# Altium schematic sheet 01 - Power Supply.SchDoc
size B; CompanyName: Microchip Technology Inc.; Organization: Microchip Technology; Address1: 2355 West Chandler Blvd.; Address2: Chandler, AZ  85224; Address4: USA; SheetNumber: 2; SheetTotal: 15; SheetTitle: Power Supply; Time: Time
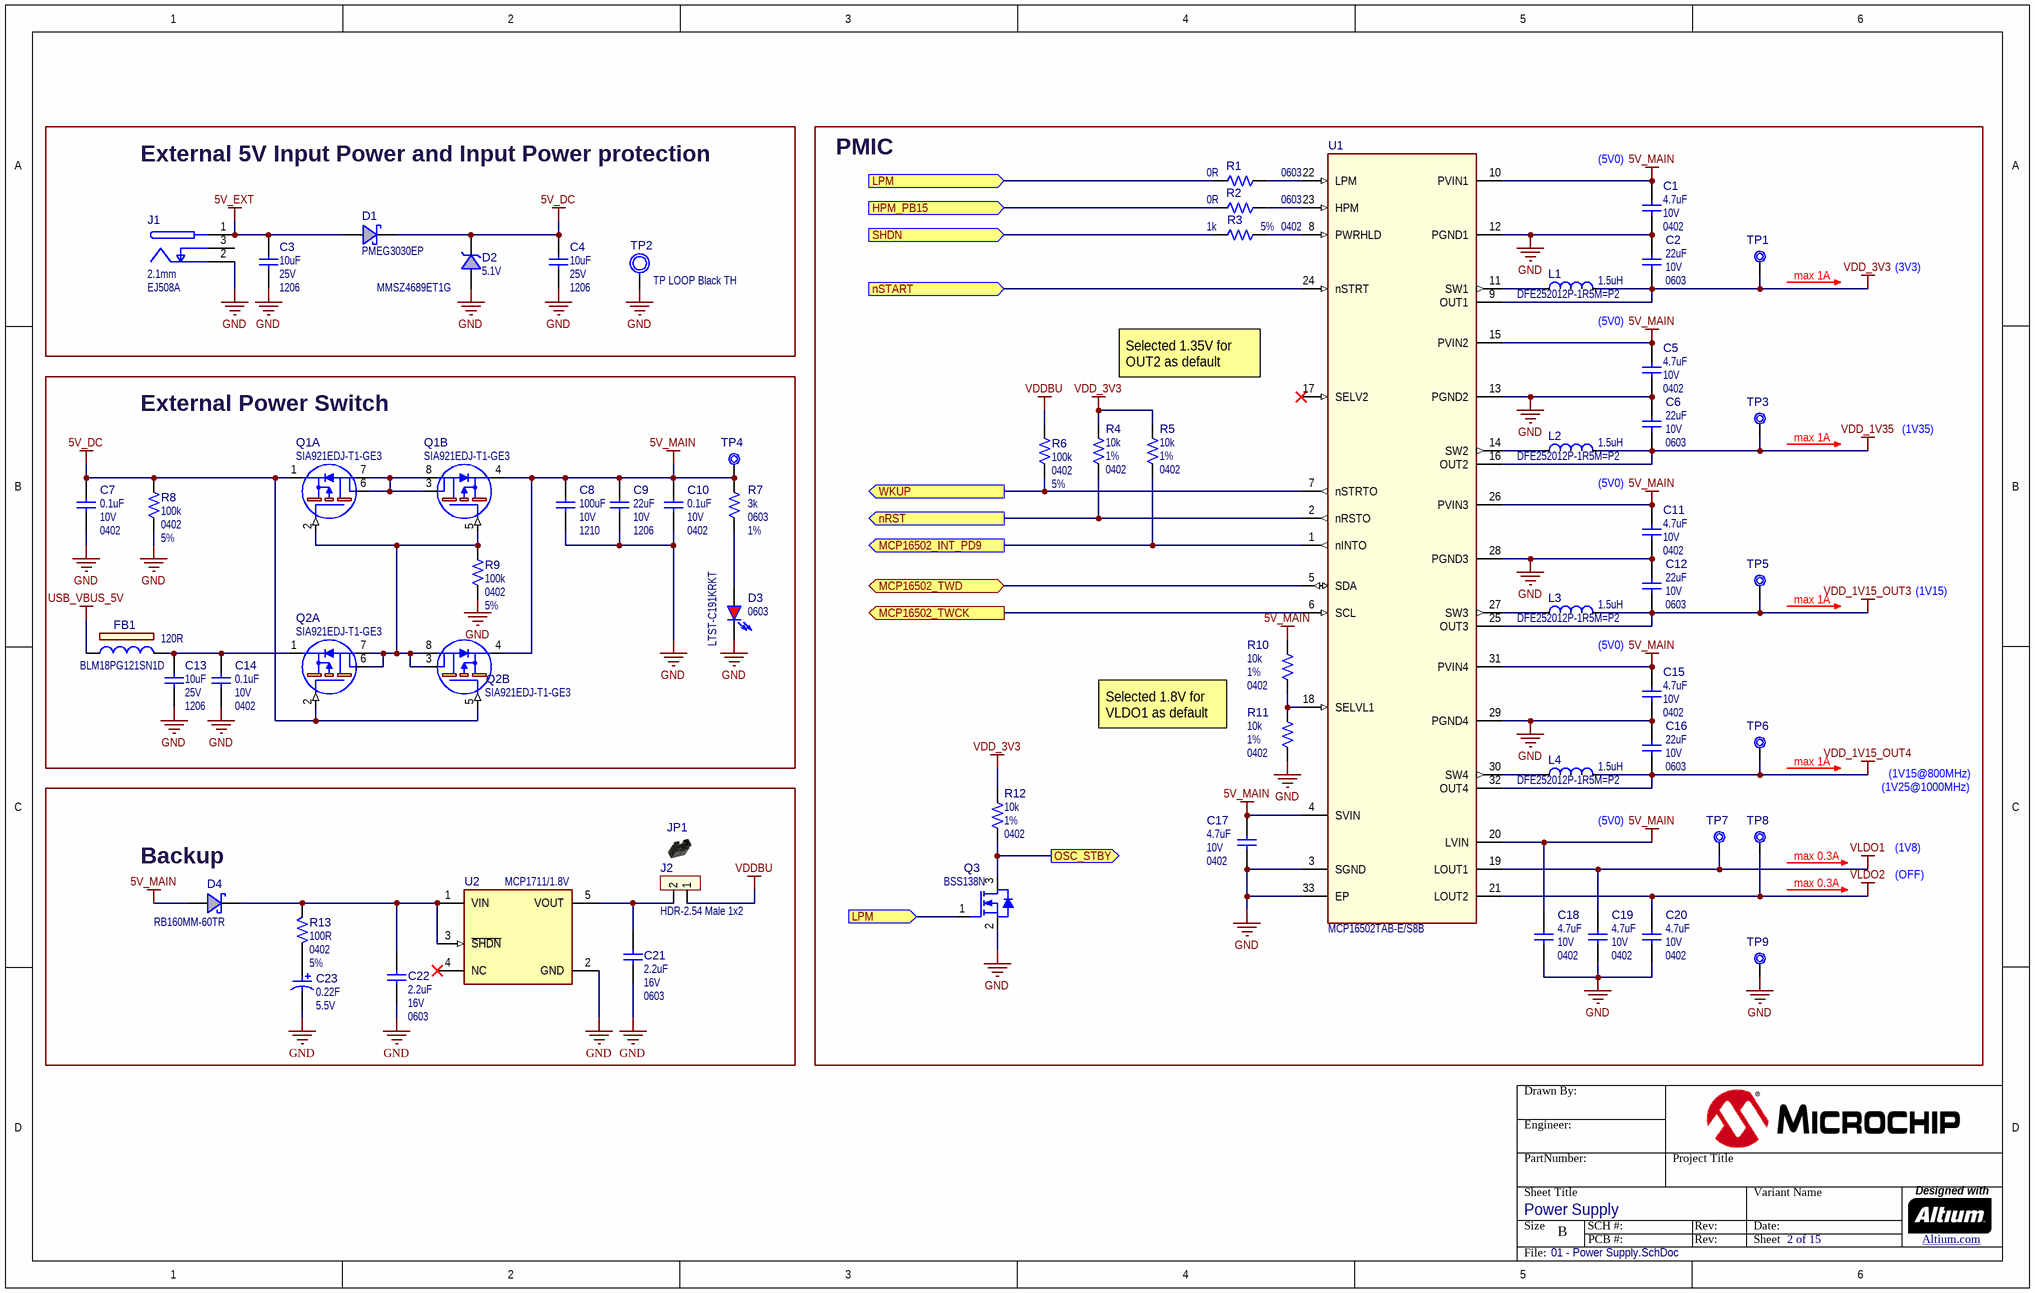
[diagram p0: 01 - Power Supply.SchDoc]

## Parts
?  (no value)  (graphical)
C1  value 4.7uF  Voltage: 10V  Package: 0402  [CAP_C_0402]  (hidden comment: Capacitor NP)
C2  value 22uF  Voltage: 10V  Package: 0603  [CAP_C_0603]  (hidden comment: Capacitor NP)
C3  value 10uF  Voltage: 25V  Package: 1206  [CAP_C_1206]  (hidden comment: Capacitor NP)
C4  value 10uF  Voltage: 25V  Package: 1206  [CAP_C_1206]  (hidden comment: Capacitor NP)
C5  value 4.7uF  Voltage: 10V  Package: 0402  [CAP_C_0402]  (hidden comment: Capacitor NP)
C6  value 22uF  Voltage: 10V  Package: 0603  [CAP_C_0603]  (hidden comment: Capacitor NP)
C7  value 0.1uF  Voltage: 10V  Package: 0402  [CAP_C_0402]  (hidden comment: Capacitor NP)
C8  value 100uF  Voltage: 10V  Package: 1210  [CAP_C_1210]  (hidden comment: Capacitor NP)
C9  value 22uF  Voltage: 10V  Package: 1206  [CAP_C_1206]  (hidden comment: Capacitor NP)
C10  value 0.1uF  Voltage: 10V  Package: 0402  [CAP_C_0402]  (hidden comment: Capacitor NP)
C11  value 4.7uF  Voltage: 10V  Package: 0402  [CAP_C_0402]  (hidden comment: Capacitor NP)
C12  value 22uF  Voltage: 10V  Package: 0603  [CAP_C_0603]  (hidden comment: Capacitor NP)
C13  value 10uF  Voltage: 25V  Package: 1206  [CAP_C_1206]  (hidden comment: Capacitor NP)
C14  value 0.1uF  Voltage: 10V  Package: 0402  [CAP_C_0402]  (hidden comment: Capacitor NP)
C15  value 4.7uF  Voltage: 10V  Package: 0402  [CAP_C_0402]  (hidden comment: Capacitor NP)
C16  value 22uF  Voltage: 10V  Package: 0603  [CAP_C_0603]  (hidden comment: Capacitor NP)
C17  value 4.7uF  Voltage: 10V  Package: 0402  [CAP_C_0402]  (hidden comment: Capacitor NP)
C18  value 4.7uF  Voltage: 10V  Package: 0402  [CAP_C_0402]  (hidden comment: Capacitor NP)
C19  value 4.7uF  Voltage: 10V  Package: 0402  [CAP_C_0402]  (hidden comment: Capacitor NP)
C20  value 4.7uF  Voltage: 10V  Package: 0402  [CAP_C_0402]  (hidden comment: Capacitor NP)
C21  value 2.2uF  Voltage: 16V  Package: 0603  [CAP_C_0603]  (hidden comment: Capacitor NP)
C22  value 2.2uF  Voltage: 16V  Package: 0603  [CAP_C_0603]  (hidden comment: Capacitor NP)
C23  value 0.22F  Voltage: 5.5V  [CAP_AX_KR-5R5V224-R]  (hidden comment: Capacitor POL)
D1  value PMEG3030EP  [SOD-128]  (hidden comment: Diode Schottky)
D2  value 5.1V  Manufacturer Part Number 1: MMSZ4689ET1G  [SOD-123]  (hidden comment: Diode Zener)
D3  Package: 0603  Manufacturer Part Number 1: LTST-C191KRKT  [LED_0603_RED]  (hidden comment: LED_red)
D4  value RB160MM-60TR  [SOD-123FL]  (hidden comment: Diode Schottky)
FB1  value 120R  Manufacturer Part Number 1: BLM18PG121SN1D  [IND_C_0603]  (hidden comment: Ferrite Bead)
J1  value 2.1mm  Manufacturer Part Number 1: EJ508A  [CON_JACK_POWER_TH_RA_MPD_EJ508A]  (hidden comment: CON JACK 2C 3P SPST)
J2  value HDR-2.54 Male 1x2  [HDR_M_2.54_1x2]  (hidden comment: Header 1x2)
JP1  Jumper Mechanical  [Jumper_Mechanical]  (value not drawn)  (mechanical)
L1  value 1.5uH  Manufacturer Part Number 1: DFE252012P-1R5M=P2  [IND_C_1008]  (hidden comment: Inductor)
L2  value 1.5uH  Manufacturer Part Number 1: DFE252012P-1R5M=P2  [IND_C_1008]  (hidden comment: Inductor)
L3  value 1.5uH  Manufacturer Part Number 1: DFE252012P-1R5M=P2  [IND_C_1008]  (hidden comment: Inductor)
L4  value 1.5uH  Manufacturer Part Number 1: DFE252012P-1R5M=P2  [IND_C_1008]  (hidden comment: Inductor)
Q1  Manufacturer Part Number 1: SIA921EDJ-T1-GE3  [SiA923AEDJ PPAK_SC70_6L]  (hidden comment: SIA923AEDJ-T1-GE3)  (parts A,B of 2)
Q2  Manufacturer Part Number 1: SIA921EDJ-T1-GE3  [SiA923AEDJ PPAK_SC70_6L]  (hidden comment: SIA923AEDJ-T1-GE3)  (parts A,B of 2)
Q3  value BSS138N  [SOT-23-3]  (hidden comment: Transistor MOS-N GSD)
R1  value 0R  Package: 0603  [RES_C_0603]  (hidden comment: Resistor)
R2  value 0R  Package: 0603  [RES_C_0603]  (hidden comment: Resistor)
R3  value 1k  Package: 0402  Tolerance: 5%  [RES_C_0402]  (hidden comment: Resistor)
R4  value 10k  Package: 0402  Tolerance: 1%  [RES_C_0402]  (hidden comment: Resistor)
R5  value 10k  Package: 0402  Tolerance: 1%  [RES_C_0402]  (hidden comment: Resistor)
R6  value 100k  Package: 0402  Tolerance: 5%  [RES_C_0402]  (hidden comment: Resistor)
R7  value 3k  Package: 0603  Tolerance: 1%  [RES_C_0603]  (hidden comment: Resistor)
R8  value 100k  Package: 0402  Tolerance: 5%  [RES_C_0402]  (hidden comment: Resistor)
R9  value 100k  Package: 0402  Tolerance: 5%  [RES_C_0402]  (hidden comment: Resistor)
R10  value 10k  Package: 0402  Tolerance: 1%  [RES_C_0402]  (hidden comment: Resistor)
R11  value 10k  Package: 0402  Tolerance: 1%  [RES_C_0402]  (hidden comment: Resistor)
R12  value 10k  Package: 0402  Tolerance: 1%  [RES_C_0402]  (hidden comment: Resistor)
R13  value 100R  Package: 0402  Tolerance: 5%  [RES_C_0402]  (hidden comment: Resistor)
TP1  Test Point No BOM  [TP_1mm_SMD]  (value not drawn)  (no BOM)
TP2  value TP LOOP Black TH  [CON_TP_TH_V_BLK_KEC_5011]  (hidden comment: GND)
TP3  Test Point No BOM  [TP_1mm_SMD]  (value not drawn)  (no BOM)
TP4  Test Point No BOM  [TP_1mm_SMD]  (value not drawn)  (no BOM)
TP5  Test Point No BOM  [TP_1mm_SMD]  (value not drawn)  (no BOM)
TP6  Test Point No BOM  [TP_1mm_SMD]  (value not drawn)  (no BOM)
TP7  Test Point No BOM  [TP_1mm_SMD]  (value not drawn)  (no BOM)
TP8  Test Point No BOM  [TP_1mm_SMD]  (value not drawn)  (no BOM)
TP9  Test Point No BOM  [TP_1mm_SMD]  (value not drawn)  (no BOM)
U1  value MCP16502TAB-E/S8B  [QFN-32_5X5_EP3.7X3.7]  (hidden comment: MCP16502 QFN-32)
U2  value MCP1711/1.8V  [SOT-23-5]  (hidden comment: MCP1711 SOT-23-5)

## Blocks framed on the sheet
External 5V Input Power and Input Power protection: C3 C4 D1 D2 J1 TP2
PMIC: C1 C2 C5 C6 C11 C12 C15-C20 L1-L4 Q3 R1-R6 R10-R12 TP1 TP3 TP5-TP9 U1
External Power Switch: C7-C10 C13 C14 D3 FB1 Q1 Q2 R7-R9 TP4
Backup: C21-C23 D4 J2 JP1 R13 U2

## Ports
HPM_PB15 (in), LPM (in), MCP16502_INT_PD9 (out), MCP16502_TWCK (out), MCP16502_TWD (bidir), nRST (out), nSTART (in), OSC_STBY (out), SHDN (in), WKUP (out)

## Nets
5V_DC: C4.1 C7.2 D1.2(K) D2.2(K) Q1.1(S1) Q2.2(G1) Q2.5(G2) R8.2
5V_EXT: C3.1 D1.1(A) J1.1(PLUS)
5V_MAIN: C1.2 C5.2 C8.2 C9.2 C10.2 C11.2 C15.2 C17.2 C18.2 D4.1(A) Q1.4(S2) Q2.4(S2) R7.1 R10.2 TP4.1 U1.4(SVIN) U1.10(PVIN1) U1.15(PVIN2) U1.20(LVIN) U1.26(PVIN3) U1.31(PVIN4)
GND: C1.1 C2.2 C3.2 C4.2 C5.1 C6.2 C7.1 C8.1 C9.1 C10.1 C11.1 C12.2 C13.2 C14.1 C15.1 C16.2 C17.1 C18.1 C19.1 C20.1 C21.1 C22.1 C23.2 D2.1(A) D3.2(K) J1.2(COM) Q3.2(S) R8.1 R9.1 R11.1 TP2.1 TP9.1 U1.3(SGND) U1.12(PGND1) U1.13(PGND2) U1.28(PGND3) U1.29(PGND4) U1.33(EP) U2.2(GND)
USB_VBUS_5V: FB1.1
VDD_1V15_OUT3: C12.1 L3.2(F) TP5.1 U1.25(OUT3)
VDD_1V15_OUT4: C16.1 L4.2(F) TP6.1 U1.32(OUT4)
VDD_1V35: C6.1 L2.2(F) TP3.1 U1.16(OUT2)
VDD_3V3: C2.1 L1.2(F) R4.2 R5.2 R12.2 TP1.1 U1.9(OUT1)
VDDBU: J2.1 R6.2
VLDO1: C19.2 TP7.1 U1.19(LOUT1)
VLDO2: C20.2 TP8.1 U1.21(LOUT2)
HPM_PB15: R2.2 ; port HPM_PB15
LPM: Q3.1(G) R1.1 ; port LPM
MCP16502_INT_PD9: R5.1 U1.1(nINTO) ; port MCP16502_INT_PD9
MCP16502_TWCK: U1.6(SCL) ; port MCP16502_TWCK
MCP16502_TWD: U1.5(SDA) ; port MCP16502_TWD
nRST: R4.1 U1.2(nRSTO) ; port nRST
nSTART: U1.24(nSTRT) ; port nSTART
OSC_STBY: Q3.3(D) R12.1 ; port OSC_STBY
SHDN: R3.2 ; port SHDN
WKUP: R6.1 U1.7(nSTRTO) ; port WKUP
NetC13_1: C13.1 C14.2 FB1.2 Q2.1(S1)
NetC21_2: C21.2 J2.2 U2.5(VOUT)
NetC22_2: C22.2 D4.2(K) R13.1 U2.1(VIN) U2.3(~{SHDN})
NetC23_1: C23.1 R13.2
NetD3_1: D3.1(A) R7.2
NetL1_1: L1.1(S) U1.11(SW1)
NetL2_1: L2.1(S) U1.14(SW2)
NetL3_1: L3.1(S) U1.27(SW3)
NetL4_1: L4.1(S) U1.30(SW4)
NetQ1_2: Q1.2(G1) Q1.5(G2) Q2.3(D2) Q2.6(D1) Q2.7(D1_2) Q2.8(D2_2) R9.2
NetQ1_3: Q1.3(D2) Q1.6(D1) Q1.7(D1_2) Q1.8(D2_2)
NetR1_2: R1.2 U1.22(LPM)
NetR2_1: R2.1 U1.23(HPM)
NetR3_1: R3.1 U1.8(PWRHLD)
NetR10_1: R10.1 R11.2 U1.18(SELVL1)

Not connected (* = marked no-connect by the designer): J1 3(SWITCH); U1 17(SELV2)*; U2 4(NC)*

## Notes on the sheet
- (near C1) (5V0)
- (near TP1) max 1A
- (3V3)
- Selected 1.35V for OUT2 as default
- (5V0)
- (near TP3) max 1A
- (1V35)
- (near TP5) max 1A
- (1V15)
- Selected 1.8V for VLDO1 as default
- (near TP6) max 1A
- (1V15@800MHz)
- (1V25@1000MHz)
- (near TP8) max 0.3A
- (1V8)
- (OFF)
- Drawn By:
- Engineer:
- PartNumber:
- Project Title
- Sheet Title
- Size
- B
- SCH #:
- PCB #:
- Rev:
- Variant Name
- Date:
- Sheet
- Designed with
- Altium.com <http://go.altium.com/MicrochipLandingPage_Evaluation.html>
- File:

## Library data of the parts
? = Title Block B
C1 C5 C11 C15 C17-C20 = CAP1684: Capacitor; Manufacturer 1: TDK Corporation; Manufacturer Part Number 1: C1005X5R1A475K050BC; Description_: CAP CER 4.7uF 10V 10% X5R SMD 0402; Dev Tools Status: Production; Tolerance: 10%; Temperature Coeffcient: X5R; Type: Ceramic; Owner: Jesus Aviles; Populated: YES; MCHP-ID: CAP1684; Revision: 1; Symbol: Capacitor NP; Status: MCL Design; ComponentLink1Description: SVN Datasheet; ComponentLink2Description: Local Datasheet; ComponentLink3URL: C:\ALTIUM_WORK\00001_MCHP-CDB\Library\LibraryRefs\Capacitor NP.SchLib; ComponentLink3Description: Open Symbol; ComponentLink4URL: C:\ALTIUM_WORK\00001_MCHP-CDB\Library\Footprints\CAP_C_0402.PcbLib; ComponentLink4Description: Open Footprint; ComponentLink5Description: Open Footprint 2; ComponentLink6Description: Open Footprint 3; ComponentLink7Description: Open Footprint 4; Operating Temperature: -55C to 85C; Category: Capacitor; Supplier 1: Digi-Key; Supplier Part Number 1: 445-13820-1-ND; Quantity Override: 1
C2 C6 C12 C16 = CAP1648: Capacitor; Manufacturer 1: TDK Corporation; Manufacturer Part Number 1: C1608X5R1A226M080AC; Description_: CAP CER 22uF 10V 20% X5R SMD 0603; Dev Tools Status: Production; Tolerance: 20%; Temperature Coeffcient: X5R; Type: Ceramic; Owner: Razvan Cristescu; Populated: YES; MCHP-ID: CAP1648; Revision: 1; Symbol: Capacitor NP; Status: MCL Design; ComponentLink1URL: https://chn-vm-apps.microchip.com/mchprepo/parts/Datasheets/1913358.pdf; ComponentLink1Description: SVN Datasheet; ComponentLink2URL: C:\ALTIUM_WORK\00001_MCHP-CDB\Datasheets\1913358.pdf; ComponentLink2Description: Local Datasheet; ComponentLink3URL: C:\ALTIUM_WORK\00001_MCHP-CDB\Library\LibraryRefs\Capacitor NP.SchLib; ComponentLink3Description: Open Symbol; ComponentLink4URL: C:\ALTIUM_WORK\00001_MCHP-CDB\Library\Footprints\CAP_C_0603.PcbLib; ComponentLink4Description: Open Footprint; ComponentLink5Description: Open Footprint 2; ComponentLink6Description: Open Footprint 3; ComponentLink7Description: Open Footprint 4; Operating Temperature: -55C to +85C; Category: Capacitor; Supplier 1: Farnell; Supplier Part Number 1: 2525091; Quantity Override: 1; Manufacturer 2: Murata Electronics North America; Manufacturer Part Number 2: GRM188R61A226ME15D; Supplier 2: Digi-Key; Supplier Part Number 2: 490-10476-1-ND
C3 C4 C13 = CAP1418: Capacitor; Manufacturer 1: Samsung Electro-Mechanics America, Inc; Manufacturer Part Number 1: CL31B106KAHNFNE; Description_: CAP CER 10uF 25V 10% X7R SMD 1206; Dev Tools Status: Design; Tolerance: 10%; Temperature Coeffcient: X7R; Type: Ceramic; Populated: YES; Owner: Sorin Stanoaia; MCHP-ID: CAP1418; Revision: A; Symbol: Capacitor NP; Status: MCL Design; ComponentLink1URL: https://chn-vm-apps.microchip.com/mchprepo/parts/Datasheets/C_CL31B106KAHNFNE.pdf; ComponentLink1Description: SVN Datasheet; ComponentLink2URL: C:\ALTIUM_WORK\00001_MCHP-CDB\Datasheets\C_CL31B106KAHNFNE.pdf; ComponentLink2Description: Local Datasheet; ComponentLink3URL: C:\ALTIUM_WORK\00001_MCHP-CDB\Library\LibraryRefs\Capacitor NP.SchLib; ComponentLink3Description: Open Symbol; ComponentLink4URL: C:\ALTIUM_WORK\00001_MCHP-CDB\Library\Footprints\CAP_C_1206.PcbLib; ComponentLink4Description: Open Footprint; ComponentLink5Description: Open Footprint 2; ComponentLink6Description: Open Footprint 3; ComponentLink7Description: Open Footprint 4; Operating Temperature: -55C to +125C; Category: Capacitor; Supplier 1: Digi-Key; Supplier Part Number 1: 1276-3100-1-ND; Quantity Override: 1
C7 C10 C14 = CAP1238: Capacitor; Manufacturer 1: KEMET; Manufacturer Part Number 1: C0402C104K8RACTU; Description_: CAP CER 0.1uF 10V 10% X7R SMD 0402; Dev Tools Status: Production; Tolerance: 10%; Temperature Coeffcient: X7R; Type: Ceramic; Owner: Tad Ahlvers; Populated: YES; MCHP-ID: CAP1238; Revision: 1; Symbol: Capacitor NP; Status: MCL Design; ComponentLink1URL: https://chn-vm-apps.microchip.com/mchprepo/parts/Datasheets/KEM_C1002_X7R_SMD.pdf; ComponentLink1Description: SVN Datasheet; ComponentLink2URL: C:\ALTIUM_WORK\00001_MCHP-CDB\Datasheets\KEM_C1002_X7R_SMD.pdf; ComponentLink2Description: Local Datasheet; ComponentLink3URL: C:\ALTIUM_WORK\00001_MCHP-CDB\Library\LibraryRefs\Capacitor NP.SchLib; ComponentLink3Description: Open Symbol; ComponentLink4URL: C:\ALTIUM_WORK\00001_MCHP-CDB\Library\Footprints\CAP_C_0402.PcbLib; ComponentLink4Description: Open Footprint; ComponentLink5Description: Open Footprint 2; ComponentLink6Description: Open Footprint 3; ComponentLink7Description: Open Footprint 4; Operating Temperature: -55C to +125C; Category: Capacitor; Manufacturer 2: Samsung; Manufacturer Part Number 2: CL05B104KP5NNNC; Manufacturer 3: Murata Electronics; Manufacturer Part Number 3: GRM155R71A104KA01D; Supplier 1: Digi-Key; Supplier Part Number 1: 399-3520-2-ND; Supplier 2: Digi-Key; Supplier Part Number 2: 1276-1002-2-ND; Supplier 3: Mouser; Supplier Part Number 3: 81-GRM155R71A104KA1D; Quantity Override: 1
C8 = CAP0598: Capacitor; Manufacturer 1: Murata Electronics North America; Manufacturer Part Number 1: GRM32ER61A107ME20L; Description_: CAP CER 100uF 10V 20% X5R SMD 1210; Dev Tools Status: Production; Tolerance: 20%; Temperature Coeffcient: X5R; Type: Ceramic; Populated: Yes; MCHP-ID: CAP0598; Revision: 1; Symbol: Capacitor NP; Status: MCL Design; ComponentLink1URL: https://chn-vm-apps.microchip.com/mchprepo/parts/Datasheets/mlcc01_e.pdf; ComponentLink1Description: SVN Datasheet; ComponentLink2URL: C:\ALTIUM_WORK\00001_MCHP-CDB\Datasheets\mlcc01_e.pdf; ComponentLink2Description: Local Datasheet; ComponentLink3URL: C:\ALTIUM_WORK\00001_MCHP-CDB\Library\LibraryRefs\Capacitor NP.SchLib; ComponentLink3Description: Open Symbol; ComponentLink4URL: C:\ALTIUM_WORK\00001_MCHP-CDB\Library\Footprints\CAP_C_1210.PcbLib; ComponentLink4Description: Open Footprint; ComponentLink5Description: Open Footprint 2; ComponentLink6Description: Open Footprint 3; ComponentLink7Description: Open Footprint 4; Operating Temperature: -55C to +85C; Category: Capacitor; Manufacturer 2: Taiyo Yuden; Manufacturer Part Number 2: LMK325BJ107MM-T; Supplier 1: Digi-Key; Supplier Part Number 1: 490-9969-1-ND; Supplier 2: Digi-Key; Supplier Part Number 2: 587-1965-1-ND; Quantity Override: 1
C9 = CAP1259: Capacitor; Manufacturer 1: Samsung Electro-Mechanics America, Inc; Manufacturer Part Number 1: CL31B226KPHNNNE; Description_: CAP CER 22uF 10V 10% X7R SMD 1206; Dev Tools Status: Production; Tolerance: 10%; Temperature Coeffcient: X7R; Type: Ceramic; Owner: Bogdan Popescu; Populated: YES; MCHP-ID: CAP1259; Revision: 1; Symbol: Capacitor NP; Status: MCL Design; ComponentLink1URL: https://chn-vm-apps.microchip.com/mchprepo/parts/Datasheets/CL31B226KPHNNNE.pdf; ComponentLink1Description: SVN Datasheet; ComponentLink2URL: C:\ALTIUM_WORK\00001_MCHP-CDB\Datasheets\CL31B226KPHNNNE.pdf; ComponentLink2Description: Local Datasheet; ComponentLink3URL: C:\ALTIUM_WORK\00001_MCHP-CDB\Library\LibraryRefs\Capacitor NP.SchLib; ComponentLink3Description: Open Symbol; ComponentLink4URL: C:\ALTIUM_WORK\00001_MCHP-CDB\Library\Footprints\CAP_C_1206.PcbLib; ComponentLink4Description: Open Footprint; ComponentLink5Description: Open Footprint 2; ComponentLink6Description: Open Footprint 3; ComponentLink7Description: Open Footprint 4; Operating Temperature: -55C to +125C; Category: Capacitor; Supplier 1: Digi-Key; Supplier Part Number 1: 1276-2769-1-ND; Quantity Override: 1
C21 C22 = CAP0597: Capacitor; Manufacturer 1: TDK; Manufacturer Part Number 1: C1608X5R1C225K; Description_: CAP CER 2.2uF 16V 10% X5R SMD 0603; Dev Tools Status: Production; Tolerance: 10%; Temperature Coeffcient: X5R; Type: Ceramic; Populated: Yes; MCHP-ID: CAP0597; Revision: 2; Symbol: Capacitor NP; Status: MCL Design; ComponentLink1URL: https://chn-vm-apps.microchip.com/mchprepo/parts/Datasheets/general_B11.pdf; ComponentLink1Description: SVN Datasheet; ComponentLink2URL: C:\ALTIUM_WORK\00001_MCHP-CDB\Datasheets\general_B11.pdf; ComponentLink2Description: Local Datasheet; ComponentLink3URL: C:\ALTIUM_WORK\00001_MCHP-CDB\Library\LibraryRefs\Capacitor NP.SchLib; ComponentLink3Description: Open Symbol; ComponentLink4URL: C:\ALTIUM_WORK\00001_MCHP-CDB\Library\Footprints\CAP_C_0603.PcbLib; ComponentLink4Description: Open Footprint; ComponentLink5Description: Open Footprint 2; ComponentLink6Description: Open Footprint 3; ComponentLink7Description: Open Footprint 4; Operating Temperature: -55C to +85C; Category: Capacitor; Supplier 1: Digi-Key; Supplier Part Number 1: 445-5157-1-ND; Quantity Override: 1
C23 = CAP2001: Capacitor; Manufacturer 1: Eaton; Manufacturer Part Number 1: KR-5R5V224-R; Description_: CAP SUPERCAP 220mF 5.5V -20% +80% 75Ohm RAD P5L10.5D11.5H11.5; Dev Tools Status: Design; Tolerance: -20% to +80%; ESR: 75R; Type: Supercap; Owner: Dragos Danaila; Populated: YES; MCHP-ID: CAP2001; Revision: A; Symbol: Capacitor POL; Status: MCL Design; ComponentLink1URL: https://chn-vm-apps.microchip.com/mchprepo/parts/Datasheets/Bus_Elx_DS_4327_KR_Series-479311.pdf; ComponentLink1Description: SVN Datasheet; ComponentLink2URL: C:\ALTIUM_WORK\00001_MCHP-CDB\Datasheets\Bus_Elx_DS_4327_KR_Series-479311.pdf; ComponentLink2Description: Local Datasheet; ComponentLink3URL: C:\ALTIUM_WORK\00001_MCHP-CDB\Library\LibraryRefs\Capacitor POL.SchLib; ComponentLink3Description: Open Symbol; ComponentLink4URL: C:\ALTIUM_WORK\00001_MCHP-CDB\Library\Footprints\CAP_AX_KR-5R5V224-R.PcbLib; ComponentLink4Description: Open Footprint; ComponentLink5Description: Open Footprint 2; ComponentLink6Description: Open Footprint 3; ComponentLink7Description: Open Footprint 4; Operating Temperature: -25C to +70C; Category: Capacitor; Supplier 1: Mouser; Supplier Part Number 1: 504-KR-5R5V224-R; Quantity Override: 1
D1 = DIODE1312: Manufacturer 1: Nexperia USA Inc.; Manufacturer Part Number 1: PMEG3030EP,115; Description_: DIO SCTKY PMEG3030EP,115 30V 3A SMD SOD-128; Dev Tools Status: Design; Type: Schottky Single; Reverse Current: 5mA; Reverse Voltage: 30V; Owner: Mark Loper; Populated: YES; MCHP-ID: DIODE1312; Revision: A; Symbol: Diode Schottky; Status: MCL Design; Package: SOD-128; ComponentLink1URL: https://chn-vm-apps.microchip.com/mchprepo/parts/Datasheets/PMEG3030EP.pdf; ComponentLink1Description: SVN Datasheet; ComponentLink2URL: C:\ALTIUM_WORK\00001_MCHP-CDB\Datasheets\PMEG3030EP.pdf; ComponentLink2Description: Local Datasheet; ComponentLink3URL: C:\ALTIUM_WORK\00001_MCHP-CDB\Library\LibraryRefs\Diode Schottky.SchLib; ComponentLink3Description: Open Symbol; ComponentLink4URL: C:\ALTIUM_WORK\00001_MCHP-CDB\Library\Footprints\SOD-128.PcbLib; ComponentLink4Description: Open Footprint; ComponentLink5Description: Open Footprint 2; ComponentLink6Description: Open Footprint 3; ComponentLink7Description: Open Footprint 4; Category: Diode; Supplier 1: Digi-Key; Supplier Part Number 1: 1727-5324-1-ND; Quantity Override: 1
D2 = DIODE1230: Manufacturer 1: Fairchild Semiconductor; Description_: DIO ZNR MMSZ4689ET1G 5.1V 500mW SMD SOD-123; Dev Tools Status: Design; Type: Zener Single; Forward Current: 10mA; Power: 500mW; Reverse Current: 10µA; Reverse Voltage: 3V; Owner: Cristian Papuc; Populated: YES; MCHP-ID: DIODE1230; Revision: 1; Symbol: Diode Zener; Status: MCL Design; Package: SOD-123; ComponentLink1URL: https://chn-vm-apps.microchip.com/mchprepo/parts/Datasheets/SZ,MMSZ4yyyET1G SeriesG_Series.pdf; ComponentLink1Description: SVN Datasheet; ComponentLink2URL: C:\ALTIUM_WORK\00001_MCHP-CDB\Datasheets\SZ,MMSZ4yyyET1G SeriesG_Series.pdf; ComponentLink2Description: Local Datasheet; ComponentLink3URL: C:\ALTIUM_WORK\00001_MCHP-CDB\Library\LibraryRefs\Diode Zener.SchLib; ComponentLink3Description: Open Symbol; ComponentLink4URL: C:\ALTIUM_WORK\00001_MCHP-CDB\Library\Footprints\SOD-123.PcbLib; ComponentLink4Description: Open Footprint; ComponentLink5Description: Open Footprint 2; ComponentLink6Description: Open Footprint 3; ComponentLink7Description: Open Footprint 4; Operating Temperature: -55C to +150C; Category: Diode; Supplier 1: Digi-Key; Supplier Part Number 1: MMSZ4689ET1GOSCT-ND; Quantity Override: 1
D3 = LED1073: LED; Manufacturer 1: Lite-On Inc.; Value: RED; Description_: DIO RED 2V 20mA 54mcd CLEAR SMD 0603; Dev Tools Status: Production; Type: LED Single; Forward Current: 20mA; Owner: Sompoch Loboonlert; Populated: YES; MCHP-ID: LED1073; Revision: 2; Symbol: LED_RED; Status: MCL Design; ComponentLink1URL: https://chn-vm-apps.microchip.com/mchprepo/parts/Datasheets/LTST-C191KRKT.PDF; ComponentLink1Description: SVN Datasheet; ComponentLink2URL: C:\ALTIUM_WORK\00001_MCHP-CDB\Datasheets\LTST-C191KRKT.PDF; ComponentLink2Description: Local Datasheet; ComponentLink3URL: C:\ALTIUM_WORK\00001_MCHP-CDB\Library\LibraryRefs\LED_RED.SchLib; ComponentLink3Description: Open Symbol; ComponentLink4URL: C:\ALTIUM_WORK\00001_MCHP-CDB\Library\Footprints\LED_0603_RED.PcbLib; ComponentLink4Description: Open Footprint; ComponentLink5Description: Open Footprint 2; ComponentLink6Description: Open Footprint 3; ComponentLink7Description: Open Footprint 4; Category: Diode; Supplier 1: Digi-Key; Supplier Part Number 1: 160-1447-1-ND; Quantity Override: 1
D4 = DIODE1609: DIO SCTKY RB160M-60TR 550mV 1A 60V SMD SOD-123F; Manufacturer 1: Rohm Semiconductor; Description_: DIO SCTKY RB160MM-60TR 550mV 1A 60V SMD SOD-123F; Dev Tools Status: Design; Type: Schottky Single; Power: 1W; Reverse Current: 50uA; Populated: YES; Owner: Ciprian Abramov; MCHP-ID: DIODE1609; Revision: 1; Symbol: Diode Schottky; Status: MCL Design; Package: SOD-123F; ComponentLink1URL: https://chn-vm-apps.microchip.com/mchprepo/parts/Datasheets/rb160m-60-210199.pdf; ComponentLink1Description: SVN Datasheet; ComponentLink2URL: C:\ALTIUM_WORK\00001_MCHP-CDB\Datasheets\rb160m-60-210199.pdf; ComponentLink2Description: Local Datasheet; ComponentLink3URL: C:\ALTIUM_WORK\00001_MCHP-CDB\Library\LibraryRefs\Diode Schottky.SchLib; ComponentLink3Description: Open Symbol; ComponentLink4URL: C:\ALTIUM_WORK\00001_MCHP-CDB\Library\Footprints\SOD-123FL.PcbLib; ComponentLink4Description: Open Footprint; ComponentLink5Description: Open Footprint 2; ComponentLink6Description: Open Footprint 3; ComponentLink7Description: Open Footprint 4; Operating Temperature: -40C to +150C; Category: Diode; Forward Current: 1A; Reverse Voltage: 60V; Manufacturer Part Number 1: RB160MM-60TR; Supplier 1: Digi-Key; Supplier Part Number 1: RB160MM-60CT-ND; Quantity Override: 1
FB1 = IND1009: Manufacturer 1: Murata; Description_: FERRITE 120R@100MHz 2A SMD 0603; Dev Tools Status: Production; Owner: Petnarong Chaijaroong; DCR: 0.05R; Saturation Current: 12A; Populated: Yes; MCHP-ID: IND1009; Revision: 0; Symbol: Ferrite Bead; Status: MCL Design; ComponentLink1URL: https://chn-vm-apps.microchip.com/mchprepo/parts/Datasheets/L0110S0100BLM18P.pdf; ComponentLink1Description: SVN Datasheet; ComponentLink2URL: C:\ALTIUM_WORK\00001_MCHP-CDB\Datasheets\L0110S0100BLM18P.pdf; ComponentLink2Description: Local Datasheet; ComponentLink3URL: C:\ALTIUM_WORK\00001_MCHP-CDB\Library\LibraryRefs\Ferrite Bead.SchLib; ComponentLink3Description: Open Symbol; ComponentLink4URL: C:\ALTIUM_WORK\00001_MCHP-CDB\Library\Footprints\IND_C_0603.PcbLib; ComponentLink4Description: Open Footprint; ComponentLink5Description: Open Footprint 2; ComponentLink6Description: Open Footprint 3; ComponentLink7Description: Open Footprint 4; Operating Temperature: -55C to +125C; Package: 0603; Type: Ferrite Bead; Category: Inductor; Supplier 1: Digi-Key; Supplier Part Number 1: 490-1037-1-ND; Quantity Override: 1
J1 = CON1560: Manufacturer 1: MPD (Memory Protection Devices); Description_: CON POWER 2.1mm 5.5mm Switch Slotted TH R/A; Dev Tools Status: Production; Populated: YES; Owner: Mark Loper; MCHP-ID: CON1560; Revision: 1; Symbol: CON JACK 2C 3P SPST; Status: MCL Design; ComponentLink1URL: https://chn-vm-apps.microchip.com/mchprepo/parts/Datasheets/EJ508A-datasheet.pdf; ComponentLink1Description: SVN Datasheet; ComponentLink2URL: C:\ALTIUM_WORK\00001_MCHP-CDB\Datasheets\EJ508A-datasheet.pdf; ComponentLink2Description: Local Datasheet; ComponentLink3URL: C:\ALTIUM_WORK\00001_MCHP-CDB\Library\LibraryRefs\CON JACK 2C 3P SPST.SchLib; ComponentLink3Description: Open Symbol; ComponentLink4URL: C:\ALTIUM_WORK\00001_MCHP-CDB\Library\Footprints\CON_JACK_POWER_TH_RA_MPD_EJ508A.PcbLib; ComponentLink4Description: Open Footprint; ComponentLink5Description: Open Footprint 2; ComponentLink6Description: Open Footprint 3; ComponentLink7Description: Open Footprint 4; Type: Jack; Category: Connector; Supplier 1: Digi-Key; Supplier Part Number 1: EJ508A-ND; Quantity Override: 1
J2 = CON1803: Manufacturer 1: Samtec Inc.; Manufacturer Part Number 1: TSW-102-07-G-S; Description_: CON HDR-2.54 Male 1x2 AU 5.84MH TH VERT; Dev Tools Status: Design; Owner: Ilie Galan; Populated: YES; MCHP-ID: CON1803; Revision: A; Symbol: Header 1x2; Status: MCL Design; ComponentLink1URL: https://chn-vm-apps.microchip.com/mchprepo/parts/Datasheets/tsw-xxx-xx-xxx-x-xx-xxx-mkt.pdf; ComponentLink1Description: SVN Datasheet; ComponentLink2URL: C:\ALTIUM_WORK\00001_MCHP-CDB\Datasheets\tsw-xxx-xx-xxx-x-xx-xxx-mkt.pdf; ComponentLink2Description: Local Datasheet; ComponentLink3URL: C:\ALTIUM_WORK\00001_MCHP-CDB\Library\LibraryRefs\Header 1x2.SchLib; ComponentLink3Description: Open Symbol; ComponentLink4URL: C:\ALTIUM_WORK\00001_MCHP-CDB\Library\Footprints\HDR_M_2.54_1x2.PcbLib; ComponentLink4Description: Open Footprint; ComponentLink5Description: Open Footprint 2; ComponentLink6Description: Open Footprint 3; ComponentLink7Description: Open Footprint 4; Type: Header 2.54mm; Category: Connector; Supplier 1: Digi-Key; Supplier Part Number 1: SAM1029-02-ND; Quantity Override: 1
JP1 = MECH0174: Manufacturer 1: Wurth Electronics Inc.; Manufacturer Part Number 1: 60900213421; Value: Shunt 2.54mm 1x2; Description_: MECH HW JUMPER 2.54mm 1x2 GOLD; Dev Tools Status: Production; Owner: Narasimha Murthy; Populated: MECH; MCHP-ID: MECH0174; Revision: 1; Symbol: Jumper Mechanical; Status: MCL Design; ComponentLink1URL: https://chn-vm-apps.microchip.com/mchprepo/parts/Datasheets/60900213421.pdf; ComponentLink1Description: SVN Datasheet; ComponentLink2URL: C:\ALTIUM_WORK\00001_MCHP-CDB\Datasheets\60900213421.pdf; ComponentLink2Description: Local Datasheet; ComponentLink3URL: C:\ALTIUM_WORK\00001_MCHP-CDB\Library\LibraryRefs\Jumper Mechanical.SchLib; ComponentLink3Description: Open Symbol; ComponentLink4URL: C:\ALTIUM_WORK\00001_MCHP-CDB\Library\Footprints\Jumper_Mechanical.PcbLib; ComponentLink4Description: Open Footprint; ComponentLink5Description: Open Footprint 2; ComponentLink6Description: Open Footprint 3; ComponentLink7Description: Open Footprint 4; Type: Jumper; Category: Hardware; Supplier 1: Digi-Key; Supplier Part Number 1: 732-2678-ND; Quantity Override: 1
L1-L4 = IND1335: Manufacturer 1: Murata Electronics North America; Description_: INDUCTOR 1.5uH 3.5A 20% SMD 1008; Dev Tools Status: Design; Owner: Razvan Cristescu; DCR: 0.06R; RMS Current: 3.5A; Test Frequency: 1MHz; Populated: YES; MCHP-ID: IND1335; Revision: A; Symbol: Inductor; Status: MCL Design; ComponentLink1URL: https://chn-vm-apps.microchip.com/mchprepo/parts/Datasheets/m_dfe252012p.pdf; ComponentLink1Description: SVN Datasheet; ComponentLink2URL: C:\ALTIUM_WORK\00001_MCHP-CDB\Datasheets\m_dfe252012p.pdf; ComponentLink2Description: Local Datasheet; ComponentLink3URL: C:\ALTIUM_WORK\00001_MCHP-CDB\Library\LibraryRefs\Inductor.SchLib; ComponentLink3Description: Open Symbol; ComponentLink4URL: C:\ALTIUM_WORK\00001_MCHP-CDB\Library\Footprints\IND_C_1008.PcbLib; ComponentLink4Description: Open Footprint; ComponentLink5Description: Open Footprint 2; ComponentLink6Description: Open Footprint 3; ComponentLink7Description: Open Footprint 4; Package: 1008; Type: Inductor; Category: Inductor; Supplier 1: Digi-Key; Supplier Part Number 1: 490-10648-6-ND; Quantity Override: 1
Q1 Q2 = TRA1527: Manufacturer 1: Vishay Siliconix; Value: SIA921EDJ-T1-GE3; Description_: TRANS FET DUAL P+P SIA923AEDJ -20V -4.5A 7.8W SC70-6L; Dev Tools Status: Design; Type: FET; Current: 4.5A; Drain to Source Voltage: 20V; Gate to Source Voltage: -1.4V; Power: 7.8W; Owner: Ciprian Abramov; Populated: YES; MCHP-ID: TRA1527; Revision: 1; Symbol: Transistor MOS-P+P Dual SIA923AEDJ-T1-GE3; Status: MCL Design; Package: PowerPAK® SC-70-6 Dual; ComponentLink1URL: https://chn-vm-apps.microchip.com/mchprepo/parts/Datasheets/sia921ed.pdf; ComponentLink1Description: SVN Datasheet; ComponentLink2URL: C:\ALTIUM_WORK\00001_MCHP-CDB\Datasheets\sia921ed.pdf; ComponentLink2Description: Local Datasheet; ComponentLink3URL: C:\ALTIUM_WORK\00001_MCHP-CDB\Library\LibraryRefs\Transistor MOS-P+P Dual SIA923AEDJ-T1-GE3.SchLib; ComponentLink3Description: Open Symbol; ComponentLink4URL: C:\ALTIUM_WORK\00001_MCHP-CDB\Library\Footprints\SiA923AEDJ PPAK_SC70_6L.PcbLib; ComponentLink4Description: Open Footprint; ComponentLink5Description: Open Footprint 2; ComponentLink6Description: Open Footprint 3; ComponentLink7Description: Open Footprint 4; Operating Temperature: -55C to +150C; Category: Transistor; Voltage: 20V; Supplier 1: Digi-Key; Supplier Part Number 1: SIA921EDJ-T1-GE3CT-ND; Quantity Override: 1
Q3 = TRA1223: Transistor MOS; Manufacturer 1: Infineon Technologies; Manufacturer Part Number 1: BSS138NH6327XTSA2; Description_: TRANS FET N-CH BSS138N 60V 230mA SOT23-3; Dev Tools Status: Production; Type: FET; Current: 230mA; Drain to Source Voltage: 60V; Gate to Source Voltage: 20V; Power: 0.36W; Owner: Dragos Danaila; Populated: YES; MCHP-ID: TRA1223; Revision: 1; Symbol: Transistor MOS-N GSD; Status: MCL Design; Package: SOT23-3; ComponentLink1URL: https://chn-vm-apps.microchip.com/mchprepo/parts/Datasheets/Infineon-BSS138N-DS-v02_86-en.pdf; ComponentLink1Description: SVN Datasheet; ComponentLink2URL: C:\ALTIUM_WORK\00001_MCHP-CDB\Datasheets\Infineon-BSS138N-DS-v02_86-en.pdf; ComponentLink2Description: Local Datasheet; ComponentLink3URL: C:\ALTIUM_WORK\00001_MCHP-CDB\Library\LibraryRefs\Transistor MOS-N GSD.SchLib; ComponentLink3Description: Open Symbol; ComponentLink4URL: C:\ALTIUM_WORK\00001_MCHP-CDB\Library\Footprints\SOT-23-3.PcbLib; ComponentLink4Description: Open Footprint; ComponentLink5Description: Open Footprint 2; ComponentLink6Description: Open Footprint 3; ComponentLink7Description: Open Footprint 4; Operating Temperature: -55C to +150C; Category: Transistor; Voltage: 60V; Supplier 1: Digi-Key; Supplier Part Number 1: BSS138NH6327XTSA2CT-ND; Quantity Override: 1
R1 R2 = RSMT0001: Manufacturer 1: Panasonic; Manufacturer Part Number 1: ERJ-3GSY0R00V; Description_: RES TKF 0R 1/10W SMD 0603; Dev Tools Status: Production; Power: 1/10W; Populated: Yes; MCHP-ID: RSMT0001; Revision: 2; Symbol: Resistor; Status: MCL Design; ComponentLink1URL: https://chn-vm-apps.microchip.com/mchprepo/parts/Datasheets/nrc.pdf; ComponentLink1Description: SVN Datasheet; ComponentLink2URL: C:\ALTIUM_WORK\00001_MCHP-CDB\Datasheets\nrc.pdf; ComponentLink2Description: Local Datasheet; ComponentLink3URL: C:\ALTIUM_WORK\00001_MCHP-CDB\Library\LibraryRefs\Resistor.SchLib; ComponentLink3Description: Open Symbol; ComponentLink4URL: C:\ALTIUM_WORK\00001_MCHP-CDB\Library\Footprints\RES_C_0603.PcbLib; ComponentLink4Description: Open Footprint; ComponentLink5Description: Open Footprint 2; ComponentLink6Description: Open Footprint 3; ComponentLink7Description: Open Footprint 4; Operating Temperature: -55C to +155C; Category: Resistor; Type: RES SMD; Composition: TKF; Manufacturer 2: Panasonic; Manufacturer Part Number 2: ERJ-3GEY0R00V; Manufacturer 3: ROHM; Manufacturer Part Number 3: MCR03EZPJ000; Manufacturer 4: Stackpole Electronics Inc; Manufacturer 5: Stackpole Electronics Inc; Manufacturer 6: Vishay; Manufacturer Part Number 6: CRCW06030000Z0EA; Manufacturer 7: Yageo; Manufacturer Part Number 7: RC0603JR-070RL; Manufacturer 8: KOA Speer; Manufacturer Part Number 8: RK73Z1JTTP; Manufacturer 9: NIC Components; Manufacturer Part Number 9: NRC06Z0TRF; Supplier 1: Digi-Key; Supplier Part Number 1: P0.0GTR-ND; Supplier 2: Digi-Key; Supplier Part Number 2: RHM0.0GCT-ND; Supplier 3: Digi-Key; Supplier 4: Digi-Key; Supplier Part Number 4: RMCF0603ZT0R00CT-ND; Supplier 5: Digi-Key; Supplier 6: Digi-Key; Supplier Part Number 6: 541-0.0GCT-ND; Supplier 7: Digi-Key; Supplier Part Number 7: 311-0.0GRCT-ND; Supplier 8: KOA Speer; Supplier Part Number 8: RK73Z1JTTP; Supplier 9: NIC Components; Supplier Part Number 9: NRC06Z0TRF; Quantity Override: 1
  R1: Manufacturer Part Number 4: RMCF0603ZT0R00; Manufacturer Part Number 5: RMCF 1/16 0 R; Supplier Part Number 3: RMCF0603ZT0R00TR-ND; Supplier Part Number 5: RMCF1/160RTR-ND
  R2: Manufacturer Part Number 4: RMCF 1/16 0 R; Manufacturer Part Number 5: RMCF0603ZT0R00; Supplier Part Number 3: RMCF1/160RTR-ND; Supplier Part Number 5: RMCF0603ZT0R00TR-ND
R3 = RSMT0316: Manufacturer 1: Panasonic; Manufacturer Part Number 1: ERJ-2GEJ102X; Description_: RES TKF 1k 5% 1/16W SMD 0402; Dev Tools Status: Production; Voltage: 50V; Temperature Coeffcient: 200ppm/C; Power: 1/16W; Owner: Tad Ahlvers; Populated: YES; MCHP-ID: RSMT0316; Revision: 1; Symbol: Resistor; Status: MCL Design; ComponentLink1URL: https://chn-vm-apps.microchip.com/mchprepo/parts/Datasheets/AOA0000CE1.pdf; ComponentLink1Description: SVN Datasheet; ComponentLink2URL: C:\ALTIUM_WORK\00001_MCHP-CDB\Datasheets\AOA0000CE1.pdf; ComponentLink2Description: Local Datasheet; ComponentLink3URL: C:\ALTIUM_WORK\00001_MCHP-CDB\Library\LibraryRefs\Resistor.SchLib; ComponentLink3Description: Open Symbol; ComponentLink4URL: C:\ALTIUM_WORK\00001_MCHP-CDB\Library\Footprints\RES_C_0402.PcbLib; ComponentLink4Description: Open Footprint; ComponentLink5Description: Open Footprint 2; ComponentLink6Description: Open Footprint 3; ComponentLink7Description: Open Footprint 4; Operating Temperature: -55C to +155C; Category: Resistor; Type: RES SMD; Composition: TKF; Supplier 1: Digi-Key; Supplier Part Number 1: P1.0KJCT-ND; Quantity Override: 1
R4 R5 R11 R12 = RSMT1019: Manufacturer 1: Panasonic; Manufacturer Part Number 1: ERJ-2RKF1002X; Description_: RES TKF 10k 1% 1/10W SMD 0402; Dev Tools Status: Production; Voltage: 50V; Temperature Coeffcient: 100ppm/C; Power: 1/10W; Owner: Brent Lanphear; Populated: Yes; MCHP-ID: RSMT1019; Revision: 2; Symbol: Resistor; Status: MCL Design; ComponentLink1URL: https://chn-vm-apps.microchip.com/mchprepo/parts/Datasheets/AOA0000CE2.pdf; ComponentLink1Description: SVN Datasheet; ComponentLink2URL: C:\ALTIUM_WORK\00001_MCHP-CDB\Datasheets\AOA0000CE2.pdf; ComponentLink2Description: Local Datasheet; ComponentLink3URL: C:\ALTIUM_WORK\00001_MCHP-CDB\Library\LibraryRefs\Resistor.SchLib; ComponentLink3Description: Open Symbol; ComponentLink4URL: C:\ALTIUM_WORK\00001_MCHP-CDB\Library\Footprints\RES_C_0402.PcbLib; ComponentLink4Description: Open Footprint; ComponentLink5Description: Open Footprint 2; ComponentLink6Description: Open Footprint 3; ComponentLink7Description: Open Footprint 4; Operating Temperature: -55C to +155C; Category: Resistor; Type: RES SMD; Composition: TKF; Supplier 1: Digi-Key; Supplier Part Number 1: P10.0KLCT-ND; Quantity Override: 1
R6 R8 R9 = RSMT0737: Manufacturer 1: Panasonic; Manufacturer Part Number 1: ERJ-2GEJ104X; Description_: RES TKF 100k 5% 1/10W SMD 0402; Dev Tools Status: Production; Temperature Coeffcient: 200ppm/C; Power: 1/10W; Populated: Yes; Voltage: 50V; MCHP-ID: RSMT0737; Revision: 1; Symbol: Resistor; Status: MCL Design; ComponentLink1URL: https://chn-vm-apps.microchip.com/mchprepo/parts/Datasheets/AOA0000CE1.pdf; ComponentLink1Description: SVN Datasheet; ComponentLink2URL: C:\ALTIUM_WORK\00001_MCHP-CDB\Datasheets\AOA0000CE1.pdf; ComponentLink2Description: Local Datasheet; ComponentLink3URL: C:\ALTIUM_WORK\00001_MCHP-CDB\Library\LibraryRefs\Resistor.SchLib; ComponentLink3Description: Open Symbol; ComponentLink4URL: C:\ALTIUM_WORK\00001_MCHP-CDB\Library\Footprints\RES_C_0402.PcbLib; ComponentLink4Description: Open Footprint; ComponentLink5Description: Open Footprint 2; ComponentLink6Description: Open Footprint 3; ComponentLink7Description: Open Footprint 4; Category: Resistor; Type: RES SMD; Composition: TKF; Supplier 1: Digi-Key; Supplier Part Number 1: P100KJCT-ND; Quantity Override: 1; Operating Temperature: -55C to +155C; Manufacturer 2: Stackpole Electronics Inc; Manufacturer Part Number 2: RMCF0402JT100K; Supplier 2: Digi-Key; Supplier Part Number 2: RMCF0402JT100KCT-ND
R7 = RES1175: Manufacturer 1: Panasonic; Manufacturer Part Number 1: ERJ-3EKF3001V; Description_: RES TKF 3k 1% 1/10W SMD 0603; Dev Tools Status: Production; Voltage: 75V; Temperature Coeffcient: 100ppm/C; Power: 1/10W; Owner: Bogdan P (M91398); Populated: Yes; MCHP-ID: RES1175; Revision: 0; Symbol: Resistor; Status: MCL Design; ComponentLink1URL: https://chn-vm-apps.microchip.com/mchprepo/parts/Datasheets/AOA0000CE2.pdf; ComponentLink1Description: SVN Datasheet; ComponentLink2URL: C:\ALTIUM_WORK\00001_MCHP-CDB\Datasheets\AOA0000CE2.pdf; ComponentLink2Description: Local Datasheet; ComponentLink3URL: C:\ALTIUM_WORK\00001_MCHP-CDB\Library\LibraryRefs\Resistor.SchLib; ComponentLink3Description: Open Symbol; ComponentLink4URL: C:\ALTIUM_WORK\00001_MCHP-CDB\Library\Footprints\RES_C_0603.PcbLib; ComponentLink4Description: Open Footprint; ComponentLink5Description: Open Footprint 2; ComponentLink6Description: Open Footprint 3; ComponentLink7Description: Open Footprint 4; Operating Temperature: -55C to +155C; Category: Resistor; Type: RES SMD; Composition: TKF; Supplier 1: Digi-Key; Supplier Part Number 1: P3.00KHCT-ND; Quantity Override: 1
R10 = RSMT1019: Manufacturer 1: Panasonic; Manufacturer Part Number 1: ERJ-2RKF1002X; Description_: RES TKF 10k 1% 1/10W SMD 0402; Dev Tools Status: Production; Voltage: 50V; Temperature Coeffcient: 100ppm/C; Power: 1/10W; Owner: Brent Lanphear; Populated: DNP; MCHP-ID: RSMT1019; Revision: 2; Symbol: Resistor; Status: MCL Design; ComponentLink1URL: https://chn-vm-apps.microchip.com/mchprepo/parts/Datasheets/AOA0000CE2.pdf; ComponentLink1Description: SVN Datasheet; ComponentLink2URL: C:\ALTIUM_WORK\00001_MCHP-CDB\Datasheets\AOA0000CE2.pdf; ComponentLink2Description: Local Datasheet; ComponentLink3URL: C:\ALTIUM_WORK\00001_MCHP-CDB\Library\LibraryRefs\Resistor.SchLib; ComponentLink3Description: Open Symbol; ComponentLink4URL: C:\ALTIUM_WORK\00001_MCHP-CDB\Library\Footprints\RES_C_0402.PcbLib; ComponentLink4Description: Open Footprint; ComponentLink5Description: Open Footprint 2; ComponentLink6Description: Open Footprint 3; ComponentLink7Description: Open Footprint 4; Operating Temperature: -55C to +155C; Category: Resistor; Type: RES SMD; Composition: TKF; Supplier 1: Digi-Key; Supplier Part Number 1: P10.0KLCT-ND; Quantity Override: 1
R13 = RES2692: Manufacturer 1: Bourns Inc.; Manufacturer Part Number 1: CR0402AJW-101GAS; Description_: RES TKF 100R 5% 1/10W SMD 0402; Dev Tools Status: Design; Voltage: 50V; Temperature Coeffcient: 200ppm/C; Power: 1/16W; Owner: Dragos Danaila; Populated: YES; MCHP-ID: RES2692; Revision: 1; Symbol: Resistor; Status: MCL Design; ComponentLink1URL: https://chn-vm-apps.microchip.com/mchprepo/parts/Datasheets/crxxxxa-as.pdf; ComponentLink1Description: SVN Datasheet; ComponentLink2URL: C:\ALTIUM_WORK\00001_MCHP-CDB\Datasheets\crxxxxa-as.pdf; ComponentLink2Description: Local Datasheet; ComponentLink3URL: C:\ALTIUM_WORK\00001_MCHP-CDB\Library\LibraryRefs\Resistor.SchLib; ComponentLink3Description: Open Symbol; ComponentLink4URL: C:\ALTIUM_WORK\00001_MCHP-CDB\Library\Footprints\RES_C_0402.PcbLib; ComponentLink4Description: Open Footprint; ComponentLink5Description: Open Footprint 2; ComponentLink6Description: Open Footprint 3; ComponentLink7Description: Open Footprint 4; Operating Temperature: -55C to +155C; Category: Resistor; Type: RES SMD; Composition: TKF; Supplier 1: Digikey; Supplier Part Number 1: CR0402AJW-101GASTR-ND; Quantity Override: 1
TP1 TP3-TP9 = CON1759: Test Point; Value: TP PAD PCB 1mm; Description_: CON TP PAD PCB 1mm SMD; Dev Tools Status: Design; Owner: Cristian Papuc; Populated: YES; MCHP-ID: CON1759; Revision: A; Symbol: Test Point No BOM; Status: MCL Design; ComponentLink1Description: SVN Datasheet; ComponentLink2Description: Local Datasheet; ComponentLink3URL: C:\ALTIUM_WORK\00001_MCHP-CDB\Library\LibraryRefs\Test Point No BOM.SchLib; ComponentLink3Description: Open Symbol; ComponentLink4URL: C:\ALTIUM_WORK\00001_MCHP-CDB\Library\Footprints\TP_1mm_SMD.PcbLib; ComponentLink4Description: Open Footprint; ComponentLink5Description: Open Footprint 2; ComponentLink6Description: Open Footprint 3; ComponentLink7Description: Open Footprint 4; Type: Test Point; Category: Connector; Quantity Override: 1
TP2 = MISC0025: Test Point; Manufacturer 1: Keystone; Manufacturer Part Number 1: 5011; Description_: CON TP LOOP Black TH; Dev Tools Status: Production; Owner: Tad Ahlvers; Populated: YES; MCHP-ID: MISC0025; Revision: 0; Symbol: Test Point; Status: MCL Design; ComponentLink1URL: https://chn-vm-apps.microchip.com/mchprepo/parts/Datasheets/M60-2p60.pdf; ComponentLink1Description: SVN Datasheet; ComponentLink2URL: C:\ALTIUM_WORK\00001_MCHP-CDB\Datasheets\M60-2p60.pdf; ComponentLink2Description: Local Datasheet; ComponentLink3URL: C:\ALTIUM_WORK\00001_MCHP-CDB\Library\LibraryRefs\Test Point.SchLib; ComponentLink3Description: Open Symbol; ComponentLink4URL: C:\ALTIUM_WORK\00001_MCHP-CDB\Library\Footprints\CON_TP_TH_V_BLK_KEC_5011.PcbLib; ComponentLink4Description: Open Footprint; ComponentLink5Description: Open Footprint 2; ComponentLink6Description: Open Footprint 3; ComponentLink7Description: Open Footprint 4; Type: Test Point; Category: Connector; Supplier 1: Digi-Key; Supplier Part Number 1: 36-5011-ND; Quantity Override: 1
U1 = MIC8878: Manufacturer 1: Microchip Technology; Populated: YES; Description_: MCHP ANALOG PMIC SWITCHER Buck ADJ MCP16502TAB-E/S8B QFN-32 for SAMA7G5 MPU with LPDDR/DDR2/DDR3; Dev Tools Status: Design; Owner: Dragos Danaila; MCHP-ID: MIC8878; Symbol: MCP16502 QFN-32; Type: Switcher; Status: MCL Design; Revision: 1; Category: MCHP-Analog; ComponentLink1Description: SVN Datasheet; ComponentLink2Description: Local Datasheet; ComponentLink3URL: C:\ALTIUM_WORK\00001_MCHP-CDB\Library\LibraryRefs\MCP16502 QFN-32.SchLib; ComponentLink3Description: Open Symbol; ComponentLink4URL: C:\ALTIUM_WORK\00001_MCHP-CDB\Library\Footprints\QFN-32_5X5_EP3.7X3.7.PcbLib; ComponentLink4Description: Open Footprint; ComponentLink5Description: Open Footprint 2; ComponentLink6Description: Open Footprint 3; ComponentLink7Description: Open Footprint 4; Manufacturer Part Number 1: MCP16502TAB-E/S8B; Supplier 1: Digi-Key; Supplier Part Number 1: 150-MCP16502TAB-E/S8BCT-ND; Quantity Override: 1; ComponentLink2URL: C:\ALTIUM_WORK\00001_MCHP-CDB\Datasheets\MCP16502-High-Performance-PMIC-for-SAMA5DX-SAM9X6-MPUs-Data-Sheet-DS20006275B.pdf
U2 = MIC6434: LDO MCP1711; Manufacturer 1: Microchip Technology; Manufacturer Part Number 1: MCP1711T-18I/OT; Description_: MCHP ANALOG LDO 1.8V MCP1711T-18I/OT SOT-23-5; Dev Tools Status: Production; Owner: Sorin Stanoaia; Populated: YES; MCHP-ID: MIC6434; Symbol: MCP1711 SOT-23-5; Type: LDO; Status: MCL Design; Revision: 1; Category: MCHP-Analog; ComponentLink1URL: https://www.microchip.com/sitesearch/search/Product%20and%20Development%20Tools/MCP1711T-18I/OT; ComponentLink1Description: SVN Datasheet; ComponentLink2Description: Local Datasheet; ComponentLink3URL: C:\ALTIUM_WORK\00001_MCHP-CDB\Library\LibraryRefs\MCP1711 SOT-23-5.SchLib; ComponentLink3Description: Open Symbol; ComponentLink4URL: C:\ALTIUM_WORK\00001_MCHP-CDB\Library\Footprints\SOT-23-5.PcbLib; ComponentLink4Description: Open Footprint; ComponentLink5Description: Open Footprint 2; ComponentLink6Description: Open Footprint 3; ComponentLink7Description: Open Footprint 4; Supplier 1: Digi-Key; Supplier Part Number 1: MCP1711T-18I/OTCT-ND; Quantity Override: 1; Operating Temperature: -40C to +85C